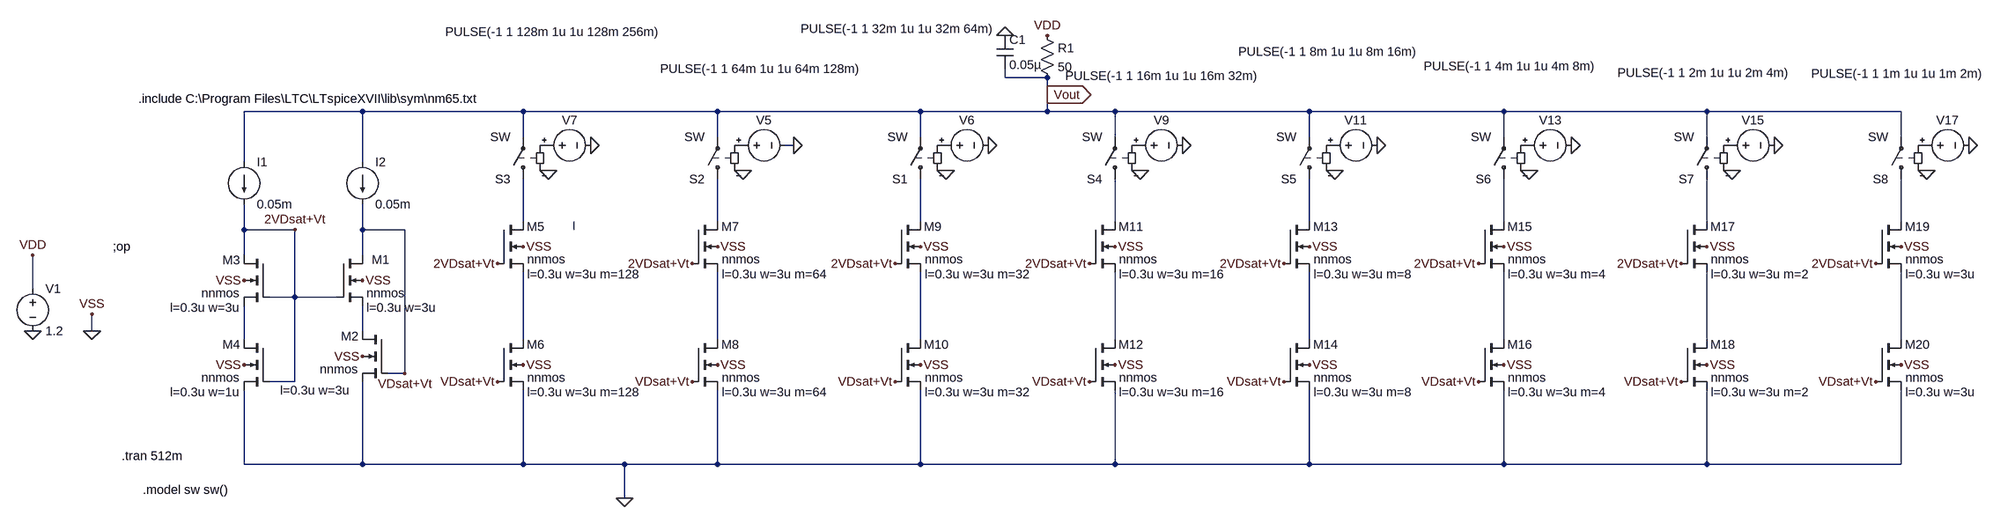
[diagram p0: schematic Simple_Sooch_DAC.asc]
Simple_Sooch_DAC.asc, the LTspice schematic file:
Version 4
SHEET 1 1980 680
WIRE 16 -400 16 -416
WIRE 96 -400 16 -400
WIRE 96 -368 96 -400
WIRE -1200 -336 -1424 -336
WIRE -896 -336 -1200 -336
WIRE -528 -336 -896 -336
WIRE -144 -336 -528 -336
WIRE 96 -336 96 -368
WIRE 96 -336 -144 -336
WIRE 224 -336 96 -336
WIRE 592 -336 224 -336
WIRE 960 -336 592 -336
WIRE 1344 -336 960 -336
WIRE 1712 -336 1344 -336
WIRE -896 -288 -896 -336
WIRE -528 -288 -528 -336
WIRE -144 -288 -144 -336
WIRE 224 -288 224 -336
WIRE 592 -288 592 -336
WIRE 960 -288 960 -336
WIRE 1344 -288 1344 -336
WIRE 1712 -288 1712 -336
WIRE -384 -272 -400 -272
WIRE -1424 -240 -1424 -336
WIRE -1200 -240 -1200 -336
WIRE -896 -128 -896 -208
WIRE -528 -128 -528 -208
WIRE -144 -128 -144 -208
WIRE 224 -128 224 -208
WIRE 592 -128 592 -208
WIRE 960 -128 960 -208
WIRE 1344 -128 1344 -208
WIRE 1712 -128 1712 -208
WIRE -1424 -112 -1424 -160
WIRE -1328 -112 -1424 -112
WIRE -1200 -112 -1200 -160
WIRE -1120 -112 -1200 -112
WIRE -800 -112 -800 -128
WIRE -1424 -64 -1424 -112
WIRE -1200 -64 -1200 -112
WIRE -1824 0 -1824 -64
WIRE -1328 16 -1328 -112
WIRE -1328 16 -1376 16
WIRE -1248 16 -1328 16
WIRE -1712 80 -1712 48
WIRE -1200 80 -1200 32
WIRE -1424 96 -1424 32
WIRE -896 96 -896 -32
WIRE -528 96 -528 -32
WIRE -144 96 -144 -32
WIRE 224 96 224 -32
WIRE 592 96 592 -32
WIRE 960 96 960 -32
WIRE 1344 96 1344 -32
WIRE 1712 96 1712 -32
WIRE -1120 160 -1120 -112
WIRE -1120 160 -1152 160
WIRE -1328 176 -1328 16
WIRE -1328 176 -1376 176
WIRE -1424 384 -1424 192
WIRE -1200 384 -1200 176
WIRE -1200 384 -1424 384
WIRE -896 384 -896 192
WIRE -896 384 -1200 384
WIRE -704 384 -896 384
WIRE -528 384 -528 192
WIRE -528 384 -704 384
WIRE -144 384 -144 192
WIRE -144 384 -528 384
WIRE 224 384 224 192
WIRE 224 384 -144 384
WIRE 592 384 592 192
WIRE 592 384 224 384
WIRE 960 384 960 192
WIRE 960 384 592 384
WIRE 1344 384 1344 192
WIRE 1344 384 960 384
WIRE 1712 384 1712 192
WIRE 1712 384 1344 384
WIRE -704 448 -704 384
FLAG -1712 80 0
FLAG -1200 -16 VSS
FLAG -1200 128 VSS
FLAG -1424 -16 VSS
FLAG -1424 144 VSS
FLAG -896 -80 VSS
FLAG -896 144 VSS
FLAG -1712 48 VSS
FLAG -1328 -112 2VDsat+Vt
FLAG -944 -48 2VDsat+Vt
FLAG -1120 160 VDsat+Vt
FLAG -1824 80 0
FLAG -1824 -64 VDD
FLAG -528 -80 VSS
FLAG -528 144 VSS
FLAG -576 -48 2VDsat+Vt
FLAG -144 -80 VSS
FLAG -144 144 VSS
FLAG -192 -48 2VDsat+Vt
FLAG -576 176 VDsat+Vt
FLAG -192 176 VDsat+Vt
FLAG -768 -272 0
FLAG -384 -272 0
FLAG -16 -272 0
FLAG -944 176 VDsat+Vt
FLAG -848 -224 0
FLAG -480 -224 0
FLAG -96 -224 0
FLAG 224 -80 VSS
FLAG 224 144 VSS
FLAG 176 -48 2VDsat+Vt
FLAG 176 176 VDsat+Vt
FLAG 352 -272 0
FLAG 272 -224 0
FLAG 592 -80 VSS
FLAG 592 144 VSS
FLAG 544 -48 2VDsat+Vt
FLAG 544 176 VDsat+Vt
FLAG 720 -272 0
FLAG 640 -224 0
FLAG 960 -80 VSS
FLAG 960 144 VSS
FLAG 912 -48 2VDsat+Vt
FLAG 912 176 VDsat+Vt
FLAG 1088 -272 0
FLAG 1008 -224 0
FLAG 1344 -80 VSS
FLAG 1344 144 VSS
FLAG 1296 -48 2VDsat+Vt
FLAG 1296 176 VDsat+Vt
FLAG 1472 -272 0
FLAG 1392 -224 0
FLAG 1712 -80 VSS
FLAG 1712 144 VSS
FLAG 1664 -48 2VDsat+Vt
FLAG 1664 176 VDsat+Vt
FLAG 1840 -272 0
FLAG 1760 -224 0
FLAG 96 -480 VDD
FLAG -704 448 0
FLAG 96 -368 Vout
IOPIN 96 -368 Out
FLAG 16 -480 0
SYMBOL nmos4 -1248 -64 R0
WINDOW 123 56 100 Left 2
WINDOW 0 66 9 Left 2
SYMATTR Value2 l=0.3u w=3u
SYMATTR InstName M1
SYMATTR Value nnmos
SYMBOL nmos4 -1152 80 M0
WINDOW 123 72 112 Left 2
WINDOW 0 55 10 Left 2
SYMATTR Value2 l=0.3u w=3u
SYMATTR InstName M2
SYMATTR Value nnmos
SYMBOL nmos4 -1376 -64 M0
WINDOW 123 56 100 Left 2
WINDOW 0 55 10 Left 2
SYMATTR Value2 l=0.3u w=3u
SYMATTR InstName M3
SYMATTR Value nnmos
SYMBOL nmos4 -1376 96 M0
WINDOW 123 56 100 Left 2
WINDOW 0 55 10 Left 2
SYMATTR Value2 l=0.3u w=1u
SYMATTR InstName M4
SYMATTR Value nnmos
SYMBOL nmos4 -944 -128 R0
WINDOW 123 56 100 Left 2
WINDOW 0 55 10 Left 2
SYMATTR Value2 l=0.3u w=3u m=128
SYMATTR InstName M5
SYMATTR Value nnmos
SYMBOL nmos4 -944 96 R0
WINDOW 123 56 100 Left 2
WINDOW 0 55 10 Left 2
SYMATTR Value2 l=0.3u w=3u m=128
SYMATTR InstName M6
SYMATTR Value nnmos
SYMBOL current -1424 -240 R0
WINDOW 123 0 0 Left 0
WINDOW 39 0 0 Left 0
SYMATTR InstName I1
SYMATTR Value 0.05m
SYMBOL current -1200 -240 R0
WINDOW 123 0 0 Left 0
WINDOW 39 0 0 Left 0
SYMATTR InstName I2
SYMATTR Value 0.05m
SYMBOL voltage -1824 -16 R0
WINDOW 123 0 0 Left 0
WINDOW 39 0 0 Left 0
SYMATTR InstName V1
SYMATTR Value 1.2
SYMBOL nmos4 -576 -128 R0
WINDOW 123 56 100 Left 2
WINDOW 0 55 10 Left 2
SYMATTR Value2 l=0.3u w=3u m=64
SYMATTR InstName M7
SYMATTR Value nnmos
SYMBOL nmos4 -576 96 R0
WINDOW 123 56 100 Left 2
WINDOW 0 55 10 Left 2
SYMATTR Value2 l=0.3u w=3u m=64
SYMATTR InstName M8
SYMATTR Value nnmos
SYMBOL nmos4 -192 -128 R0
WINDOW 123 56 100 Left 2
WINDOW 0 55 10 Left 2
SYMATTR Value2 l=0.3u w=3u m=32
SYMATTR InstName M9
SYMATTR Value nnmos
SYMBOL nmos4 -192 96 R0
WINDOW 123 56 100 Left 2
WINDOW 0 55 10 Left 2
SYMATTR Value2 l=0.3u w=3u m=32
SYMATTR InstName M10
SYMATTR Value nnmos
SYMBOL voltage -496 -272 M90
WINDOW 0 -32 56 VBottom 2
WINDOW 3 -160 49 VTop 2
WINDOW 123 0 0 Left 0
WINDOW 39 0 0 Left 0
SYMATTR InstName V5
SYMATTR Value PULSE(-1 1 64m 1u 1u 64m 128m)
SYMBOL voltage -112 -272 M90
WINDOW 0 -32 56 VBottom 2
WINDOW 3 -236 -76 VTop 2
WINDOW 123 0 0 Left 0
WINDOW 39 0 0 Left 0
SYMATTR InstName V6
SYMATTR Value PULSE(-1 1 32m 1u 1u 32m 64m)
SYMBOL voltage -864 -272 M90
WINDOW 0 -32 56 VBottom 2
WINDOW 3 -230 24 VTop 2
WINDOW 123 0 0 Left 0
WINDOW 39 0 0 Left 0
SYMATTR InstName V7
SYMATTR Value PULSE(-1 1 128m 1u 1u 128m 256m)
SYMBOL sw -144 -192 R180
SYMATTR InstName S1
SYMBOL sw -528 -192 R180
SYMATTR InstName S2
SYMBOL sw -896 -192 R180
SYMATTR InstName S3
SYMBOL nmos4 176 -128 R0
WINDOW 123 56 100 Left 2
WINDOW 0 55 10 Left 2
SYMATTR Value2 l=0.3u w=3u m=16
SYMATTR InstName M11
SYMATTR Value nnmos
SYMBOL nmos4 176 96 R0
WINDOW 123 56 100 Left 2
WINDOW 0 55 10 Left 2
SYMATTR Value2 l=0.3u w=3u m=16
SYMATTR InstName M12
SYMATTR Value nnmos
SYMBOL voltage 256 -272 M90
WINDOW 0 -32 56 VBottom 2
WINDOW 3 -147 57 VTop 2
WINDOW 123 0 0 Left 0
WINDOW 39 0 0 Left 0
SYMATTR InstName V9
SYMATTR Value PULSE(-1 1 16m 1u 1u 16m 32m)
SYMBOL sw 224 -192 R180
SYMATTR InstName S4
SYMBOL nmos4 544 -128 R0
WINDOW 123 56 100 Left 2
WINDOW 0 55 10 Left 2
SYMATTR Value2 l=0.3u w=3u m=8
SYMATTR InstName M13
SYMATTR Value nnmos
SYMBOL nmos4 544 96 R0
WINDOW 123 56 100 Left 2
WINDOW 0 55 10 Left 2
SYMATTR Value2 l=0.3u w=3u m=8
SYMATTR InstName M14
SYMATTR Value nnmos
SYMBOL voltage 624 -272 M90
WINDOW 0 -32 56 VBottom 2
WINDOW 3 -193 3 VTop 2
WINDOW 123 0 0 Left 0
WINDOW 39 0 0 Left 0
SYMATTR InstName V11
SYMATTR Value PULSE(-1 1 8m 1u 1u 8m 16m)
SYMBOL sw 592 -192 R180
SYMATTR InstName S5
SYMBOL nmos4 912 -128 R0
WINDOW 123 56 100 Left 2
WINDOW 0 55 10 Left 2
SYMATTR Value2 l=0.3u w=3u m=4
SYMATTR InstName M15
SYMATTR Value nnmos
SYMBOL nmos4 912 96 R0
WINDOW 123 56 100 Left 2
WINDOW 0 55 10 Left 2
SYMATTR Value2 l=0.3u w=3u m=4
SYMATTR InstName M16
SYMATTR Value nnmos
SYMBOL voltage 992 -272 M90
WINDOW 0 -32 56 VBottom 2
WINDOW 3 -165 -21 VTop 2
WINDOW 123 0 0 Left 0
WINDOW 39 0 0 Left 0
SYMATTR InstName V13
SYMATTR Value PULSE(-1 1 4m 1u 1u 4m 8m)
SYMBOL sw 960 -192 R180
SYMATTR InstName S6
SYMBOL nmos4 1296 -128 R0
WINDOW 123 56 100 Left 2
WINDOW 0 55 10 Left 2
SYMATTR Value2 l=0.3u w=3u m=2
SYMATTR InstName M17
SYMATTR Value nnmos
SYMBOL nmos4 1296 96 R0
WINDOW 123 56 100 Left 2
WINDOW 0 55 10 Left 2
SYMATTR Value2 l=0.3u w=3u m=2
SYMATTR InstName M18
SYMATTR Value nnmos
SYMBOL voltage 1376 -272 M90
WINDOW 0 -32 56 VBottom 2
WINDOW 3 -153 -38 VTop 2
WINDOW 123 0 0 Left 0
WINDOW 39 0 0 Left 0
SYMATTR InstName V15
SYMATTR Value PULSE(-1 1 2m 1u 1u 2m 4m)
SYMBOL sw 1344 -192 R180
SYMATTR InstName S7
SYMBOL nmos4 1664 -128 R0
WINDOW 123 56 100 Left 2
WINDOW 0 55 10 Left 2
SYMATTR Value2 l=0.3u w=3u
SYMATTR InstName M19
SYMATTR Value nnmos
SYMBOL nmos4 1664 96 R0
WINDOW 123 56 100 Left 2
WINDOW 0 55 10 Left 2
SYMATTR Value2 l=0.3u w=3u
SYMATTR InstName M20
SYMATTR Value nnmos
SYMBOL voltage 1744 -272 M90
WINDOW 0 -32 56 VBottom 2
WINDOW 3 -151 -39 VTop 2
WINDOW 123 0 0 Left 0
WINDOW 39 0 0 Left 0
SYMATTR InstName V17
SYMATTR Value PULSE(-1 1 1m 1u 1u 1m 2m)
SYMBOL sw 1712 -192 R180
SYMATTR InstName S8
SYMBOL cap 0 -480 R0
SYMATTR InstName C1
SYMATTR Value 0.05µ
SYMBOL res 80 -496 R0
SYMATTR InstName R1
SYMATTR Value 50
TEXT -1624 -360 Left 2 !.include C:\\Program Files\\LTC\\LTspiceXVII\\lib\\sym\\nm65.txt
TEXT -1672 -80 Left 2 !;op
TEXT -1656 368 Left 2 !.tran 512m
TEXT -1616 432 Left 2 !.model sw sw()

The netlist it stands for:
* Simple_Sooch_DAC.asc
M1 VDsat+Vt 2VDsat+Vt N010 0 nnmos l=0.3u w=3u
M2 N010 VDsat+Vt 0 0 nnmos l=0.3u w=3u
M3 2VDsat+Vt 2VDsat+Vt N011 0 nnmos l=0.3u w=3u
M4 N011 2VDsat+Vt 0 0 nnmos l=0.3u w=1u
M5 N001 2VDsat+Vt N012 0 nnmos l=0.3u w=3u m=128
M6 N012 VDsat+Vt 0 0 nnmos l=0.3u w=3u m=128
I1 Vout 2VDsat+Vt 0.05m
I2 Vout VDsat+Vt 0.05m
V1 VDD 0 1.2
M7 N002 2VDsat+Vt N013 0 nnmos l=0.3u w=3u m=64
M8 N013 VDsat+Vt 0 0 nnmos l=0.3u w=3u m=64
M9 N003 2VDsat+Vt N014 0 nnmos l=0.3u w=3u m=32
M10 N014 VDsat+Vt 0 0 nnmos l=0.3u w=3u m=32
V5 P001 0 PULSE(-1 1 64m 1u 1u 64m 128m)
V6 P002 0 PULSE(-1 1 32m 1u 1u 32m 64m)
V7 P003 0 PULSE(-1 1 128m 1u 1u 128m 256m)
S1 N003 Vout P002 0 SW
S2 N002 Vout P001 0 SW
S3 N001 Vout P003 0 SW
M11 N004 2VDsat+Vt N015 0 nnmos l=0.3u w=3u m=16
M12 N015 VDsat+Vt 0 0 nnmos l=0.3u w=3u m=16
V9 P004 0 PULSE(-1 1 16m 1u 1u 16m 32m)
S4 N004 Vout P004 0 SW
M13 N005 2VDsat+Vt N016 0 nnmos l=0.3u w=3u m=8
M14 N016 VDsat+Vt 0 0 nnmos l=0.3u w=3u m=8
V11 P005 0 PULSE(-1 1 8m 1u 1u 8m 16m)
S5 N005 Vout P005 0 SW
M15 N006 2VDsat+Vt N017 0 nnmos l=0.3u w=3u m=4
M16 N017 VDsat+Vt 0 0 nnmos l=0.3u w=3u m=4
V13 P006 0 PULSE(-1 1 4m 1u 1u 4m 8m)
S6 N006 Vout P006 0 SW
M17 N007 2VDsat+Vt N018 0 nnmos l=0.3u w=3u m=2
M18 N018 VDsat+Vt 0 0 nnmos l=0.3u w=3u m=2
V15 P007 0 PULSE(-1 1 2m 1u 1u 2m 4m)
S7 N007 Vout P007 0 SW
M19 N008 2VDsat+Vt N019 0 nnmos l=0.3u w=3u
M20 N019 VDsat+Vt 0 0 nnmos l=0.3u w=3u
V17 P008 0 PULSE(-1 1 1m 1u 1u 1m 2m)
S8 N008 Vout P008 0 SW
C1 0 Vout 0.05µ
R1 VDD Vout 50
.model NMOS NMOS
.model PMOS PMOS
.lib standard.mos
.include C:\Program Files\LTC\LTspiceXVII\lib\sym\nm65.txt
;op
.tran 512m
.model sw sw()
.backanno
.end